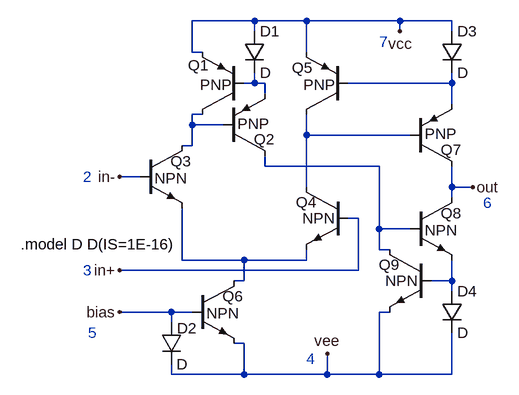
[diagram p0: schematic lm3080_.asc]
lm3080_.asc, the LTspice schematic file:
Version 4
SHEET 1 880 680
WIRE -192 288 -224 288
WIRE -144 496 -224 496
WIRE -144 512 -144 496
WIRE -144 592 -144 576
WIRE -128 416 -128 336
WIRE -112 96 -112 48
WIRE -112 208 -112 192
WIRE -112 240 -128 240
WIRE -112 240 -112 208
WIRE -112 496 -144 496
WIRE -96 96 -112 96
WIRE -96 192 -112 192
WIRE -64 208 -112 208
WIRE -32 416 -128 416
WIRE -32 448 -48 448
WIRE -32 448 -32 416
WIRE -32 544 -48 544
WIRE -32 592 -144 592
WIRE -32 592 -32 544
WIRE -16 48 -112 48
WIRE -16 64 -16 48
WIRE -16 144 -32 144
WIRE -16 144 -16 128
WIRE 0 144 -16 144
WIRE 0 160 0 144
WIRE 0 272 0 256
WIRE 64 48 -16 48
WIRE 64 96 64 48
WIRE 64 224 64 192
WIRE 64 304 64 224
WIRE 64 416 -32 416
WIRE 64 416 64 400
WIRE 96 592 -32 592
WIRE 96 592 96 560
WIRE 144 352 128 352
WIRE 144 432 -224 432
WIRE 144 432 144 352
WIRE 176 272 0 272
WIRE 176 368 176 272
WIRE 176 400 176 368
WIRE 176 592 96 592
WIRE 176 592 176 496
WIRE 192 400 176 400
WIRE 192 496 176 496
WIRE 208 48 64 48
WIRE 208 64 208 48
WIRE 224 224 64 224
WIRE 224 368 176 368
WIRE 288 48 208 48
WIRE 288 64 288 48
WIRE 288 144 128 144
WIRE 288 144 288 128
WIRE 288 176 288 144
WIRE 288 304 288 272
WIRE 288 320 288 304
WIRE 288 448 256 448
WIRE 288 448 288 416
WIRE 288 464 288 448
WIRE 288 592 176 592
WIRE 288 592 288 528
WIRE 320 304 288 304
FLAG -224 288 in-
FLAG -224 432 in+
FLAG -224 496 bias
FLAG 96 560 vee
FLAG 320 304 out
FLAG 208 64 vcc
SYMBOL pnp2 -32 192 R180
WINDOW 0 54 76 Left 0
WINDOW 3 19 46 Left 0
SYMATTR InstName Q1
SYMBOL pnp2 -64 256 M180
WINDOW 0 47 26 Left 0
WINDOW 3 22 50 Left 0
SYMATTR InstName Q2
SYMBOL diode -32 64 R0
SYMATTR InstName D1
SYMBOL npn2 -192 240 R0
WINDOW 0 47 24 Left 0
WINDOW 3 22 50 Left 0
SYMATTR InstName Q3
SYMBOL npn2 128 304 M0
WINDOW 0 48 23 Left 0
WINDOW 3 20 48 Left 0
SYMATTR InstName Q4
SYMBOL pnp2 128 192 R180
WINDOW 0 54 72 Left 0
WINDOW 3 20 46 Left 0
SYMATTR InstName Q5
SYMBOL npn2 -112 448 R0
WINDOW 0 47 24 Left 0
WINDOW 3 22 50 Left 0
SYMATTR InstName Q6
SYMBOL diode -160 512 R0
WINDOW 0 25 9 Left 0
SYMATTR InstName D2
SYMBOL pnp2 224 272 M180
WINDOW 0 47 26 Left 0
WINDOW 3 22 50 Left 0
SYMATTR InstName Q7
SYMBOL diode 272 64 R0
SYMATTR InstName D3
SYMBOL npn2 224 320 R0
WINDOW 0 47 24 Left 0
WINDOW 3 22 50 Left 0
SYMATTR InstName Q8
SYMBOL npn2 256 400 M0
WINDOW 0 48 23 Left 0
WINDOW 3 20 48 Left 0
SYMATTR InstName Q9
SYMBOL diode 272 464 R0
SYMATTR InstName D4
TEXT -280 288 Left 0 ;2
TEXT -280 432 Left 0 ;3
TEXT -272 528 Left 0 ;5
TEXT 64 568 Left 0 ;4
TEXT 336 328 Left 0 ;6
TEXT 176 80 Left 0 ;7
TEXT -376 392 Left 0 !.model D D(IS=1E-16)

The netlist it stands for:
* lm3080_.asc
Q1 N002 N003 vcc 0 PNP
Q2 N004 N002 N003 0 PNP
D1 vcc N003 D
Q3 N002 in- N001 0 NPN
Q4 N005 in+ N001 0 NPN
Q5 N005 N006 vcc 0 PNP
Q6 N001 bias vee 0 NPN
D2 bias vee D
Q7 out N005 N006 0 PNP
D3 vcc N006 D
Q8 out N004 N007 0 NPN
Q9 N004 N007 vee 0 NPN
D4 N007 vee D
.model D D
.lib standard.dio
.model NPN NPN
.model PNP PNP
.lib standard.bjt
* 2
* 3
* 5
* 4
* 6
* 7
.model D D(IS=1E-16)
.backanno
.end